# EAGLE design gamepad (EAGLE 9.5.1)
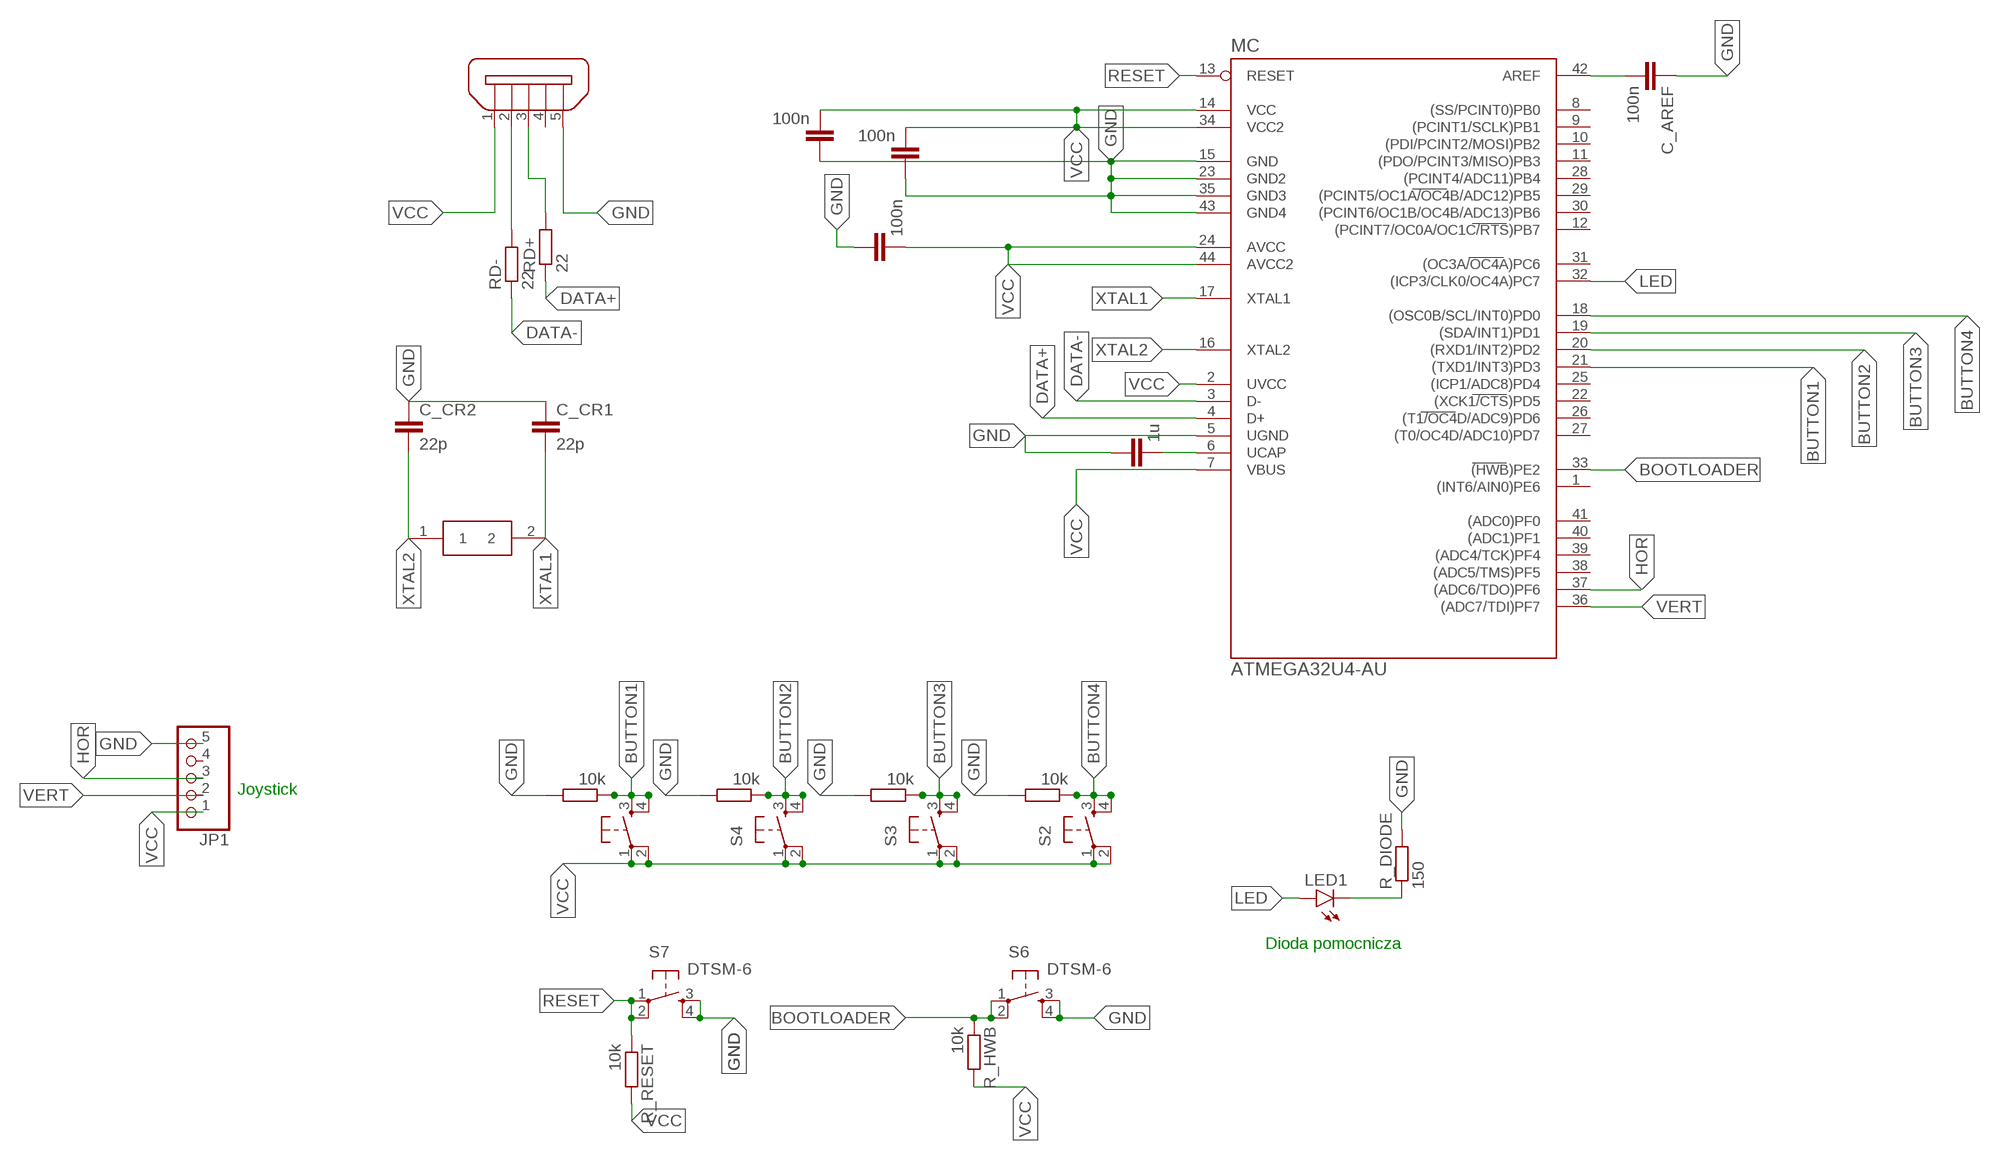
[diagram p0: schematic, sheet 1]

## Parts
C_AREF  100n  C-EUC0805  [C0805]
C_CR1  22p  C-EUC0805  [C0805]
C_CR2  22p  C-EUC0805  [C0805]
C_LPF  100n  C-EUC0805  [C0805]
C_UCAPR  1u  C-EUC0805  [C0805]
C_VCC_TO_GND_14  100n  C-EUC0805  [C0805]
C_VCC_TO_GND_33  100n  C-EUC0805  [C0805]
JP1  PINHD-1X5  [1X05]
LED1  LEDSML1206  [SML1206]
MC  ATMEGA32U4-AU  [TQFP44]
QUARTZ_OSC_ZAST  ECS-160-8-30Q-VY-TR  [ECS80830QVSTR]
R_DIODE  150  R-EU_R2512  [R2512]
R_H_SWITCH1  10k  R-EU_R0805  [R0805]
R_H_SWITCH2  10k  R-EU_R0805  [R0805]
R_H_SWITCH3  10k  R-EU_R0805  [R0805]
R_H_SWITCH4  10k  R-EU_R0805  [R0805]
R_HWB  10k  R-EU_R0805  [R0805]
R_RESET  10k  R-EU_R0805  [R0805]
RD+  22  R-EU_R0805  [R0805]
RD-  22  R-EU_R0805  [R0805]
S2  DTSM-6  [DTSM-6]
S3  DTSM-6  [DTSM-6]
S4  DTSM-6  [DTSM-6]
S5  DTSM-6  [DTSM-6]
S6  DTSM-6  [DTSM-6]
S7  DTSM-6  [DTSM-6]
X1  ZX62D-B-5PA8  [ZX62D-B-5PA8]

## Nets
BOOTLOADER: MC.33((HWB)PE2) R_HWB.1 S6.1 S6.2
BUTTON1: MC.21((TXD1/INT3)PD3) R_H_SWITCH1.1 S5.3 S5.4
BUTTON2: MC.20((RXD1/INT2)PD2) R_H_SWITCH2.1 S4.3 S4.4
BUTTON3: MC.19((SDA/INT1)PD1) R_H_SWITCH3.1 S3.3 S3.4
BUTTON4: MC.18((OSC0B/SCL/INT0)PD0) R_H_SWITCH4.1 S2.3 S2.4
DATA+: MC.4(D+) RD+.1
DATA+CON: RD+.2 X1.3
DATA-: MC.3(D-) RD-.1
DATA-CON: RD-.2 X1.2
GND: C_AREF.1 C_CR1.1 C_CR2.1 C_LPF.1 C_UCAPR.1 C_VCC_TO_GND_14.1 C_VCC_TO_GND_33.1 JP1.5 MC.5(UGND) MC.15(GND) MC.23(GND2) MC.35(GND3) MC.43(GND4) R_DIODE.2 R_H_SWITCH1.2 R_H_SWITCH2.2 R_H_SWITCH3.2 R_H_SWITCH4.2 S6.3 S6.4 S7.3 S7.4 X1.5
HOR: JP1.3 MC.37((ADC6/TDO)PF6)
LED: LED1.A MC.32((ICP3/CLK0/OC4A)PC7)
N$7: LED1.C R_DIODE.1
N$10: C_UCAPR.2 MC.6(UCAP)
N$23: C_AREF.2 MC.42(AREF)
RESET: MC.13(RESET) R_RESET.1 S7.1 S7.2
VCC: C_LPF.2 C_VCC_TO_GND_14.2 C_VCC_TO_GND_33.2 JP1.1 MC.2(UVCC) MC.7(VBUS) MC.14(VCC) MC.24(AVCC) MC.34(VCC2) MC.44(AVCC2) R_HWB.2 R_RESET.2 S2.1 S2.2 S3.1 S3.2 S4.1 S4.2 S5.1 S5.2 X1.1
VERT: JP1.2 MC.36((ADC7/TDI)PF7)
XTAL1: C_CR1.2 MC.17(XTAL1) QUARTZ_OSC_ZAST.2
XTAL2: C_CR2.2 MC.16(XTAL2) QUARTZ_OSC_ZAST.1
Unconnected: JP1.4 MC.1((INT6/AIN0)PE6) MC.8((SS/PCINT0)PB0) MC.9((PCINT1/SCLK)PB1) MC.10((PDI/PCINT2/MOSI)PB2) MC.11((PDO/PCINT3/MISO)PB3) MC.12((PCINT7/OC0A/OC1C/RTS)PB7) MC.22((XCK1/CTS)PD5) MC.25((ICP1/ADC8)PD4) MC.26((T1/OC4D/ADC9)PD6) MC.27((T0/OC4D/ADC10)PD7) MC.28((PCINT4/ADC11)PB4) MC.29((PCINT5/OC1A/OC4B/ADC12)PB5) MC.30((PCINT6/OC1B/OC4B/ADC13)PB6) MC.31((OC3A/OC4A)PC6) MC.38((ADC5/TMS)PF5) MC.39((ADC4/TCK)PF4) MC.40((ADC1)PF1) MC.41((ADC0)PF0) X1.4 X1.S1 X1.S2 X1.S3 X1.S4

## Notes on the sheet
- Joystick
- Dioda pomocnicza

## Library data of the parts
C_AREF C_CR1 C_CR2 C_LPF C_UCAPR C_VCC_TO_GND_14 C_VCC_TO_GND_33 = rcl:C-EU: CAPACITOR, European symbol; SPICEPREFIX: C
JP1 = pinhead:PINHD-1X5: PIN HEADER
LED1 = led:LED: LED OSRAM: - CHIPLED LG R971, LG N971, LY N971, LG Q971, LY Q971, LO R971, LY R971 LH N974, LH R974 LS Q976, LO Q976, LY Q976 LO Q996 - Hyper CHIPLED LW Q18S LB Q993, LB Q99A, LB R99A - SideLED LS A670, LO A670, LY A670, LG A670, LP A670 LB A673, LV A673, LT A673, LW A673 LH A674 LY A675 LS A676, LA A676, LO A676, LY A676, LW A676 LS A679, LY A679, LG A679 - Hyper Micro SIDELED® LS Y876, LA Y876, LO Y876, LY Y876 LT Y87S - SmartLED LW L88C, LW L88S LB L89C, LB L89S, LG L890 LS L89K, LO L89K, LY L89K LS L896, LA L896, LO L896, LY L896 - TOPLED LS T670, LO T670, LY T670, LG T670, LP T670 LSG T670, LSP T670, LSY T670, LOP T670, LYG T670 LG T671, LOG T671, LSG T671 LB T673, LV T673, LT T673, LW T673 LH T674 LS T676, LA T676, LO T676, LY T676, LB T676, LH T676, LSB T676, LW T676 LB T67C, LV T67C, LT T67C, LS T67K, LO T67K, LY T67K, LW E67C LS E67B, LA E67B, LO E67B, LY E67B, LB E67C, LV E67C, LT E67C LW T67C LS T679, LY T679, LG T679 LS T770, LO T770, LY T770, LG T770, LP T770 LB T773, LV T773, LT T773, LW T773 LH T774 LS E675, LA E675, LY E675, LS T675 LS T776, LA T776, LO T776, LY T776, LB T776 LHGB T686 LT T68C, LB T68C - Hyper Mini TOPLED® LB M676 - Mini TOPLED Santana® LG M470 LS M47K, LO M47K, LY M47K Source: http://www.osram.convergy.de LUXEON: - LUMILED® LXK2-PW12-R00, LXK2-PW12-S00, LXK2-PW14-U00, LXK2-PW14-V00 LXK2-PM12-R00, LXK2-PM12-S00, LXK2-PM14-U00 LXK2-PE12-Q00, LXK2-PE12-R00, LXK2-PE12-S00, LXK2-PE14-T00, LXK2-PE14-U00 LXK2-PB12-K00, LXK2-PB12-L00, LXK2-PB12-M00, LXK2-PB14-N00, LXK2-PB14-P00, LXK2-PB14-Q00 LXK2-PR12-L00, LXK2-PR12-M00, LXK2-PR14-Q00, LXK2-PR14-R00 LXK2-PD12-Q00, LXK2-PD12-R00, LXK2-PD12-S00 LXK2-PH12-R00, LXK2-PH12-S00 LXK2-PL12-P00, LXK2-PL12-Q00, LXK2-PL12-R00 Source: www.luxeon.com KINGBRIGHT: KA-3528ASYC Source: www.kingbright.com
MC = mega32U4:ATMEGA32U4-AU
QUARTZ_OSC_ZAST = ECS-160-8-30Q-VY-TR:ECS-160-8-30Q-VY-TR: Crystals 16MHz 8pF AEC ESR 50 -40C +150C Source: Datasheet <https://media.digikey.com/pdf/Data Sheets/ECS PDFs/ECX-53Q_DS.pdf>; DESCRIPTION: Crystals 16MHz 8pF AEC ESR 50 -40C +150C; HEIGHT: 1.1mm; MANUFACTURER_NAME: ECS; MANUFACTURER_PART_NUMBER: ECS-160-8-30Q-VY-TR; MOUSER_PART_NUMBER: 520-160-8-30Q-VYT; MOUSER_PRICE-STOCK: https://www.mouser.com/Search/Refine.aspx?Keyword=520-160-8-30Q-VYT
R_DIODE R_H_SWITCH1-R_H_SWITCH4 R_HWB R_RESET RD+ RD- = rcl:R-EU_: RESISTOR, European symbol; SPICEPREFIX: R
S2-S7 = switch-tact:DTSM-6
X1 = zx62d-b-5pa8-oshpark_10:ZX62D-B-5PA8: Micro USB Type B Connector - Standard, Shell Through Hole Source: http://www.hirose.co.jp/cataloge_hp/ed_ZX_20140804.pdf; MF: Hirose; MPN: ZX62D-B-5PA8; OC_FARNELL: 2300438; OC_NEWARK: 69W0712

## Board
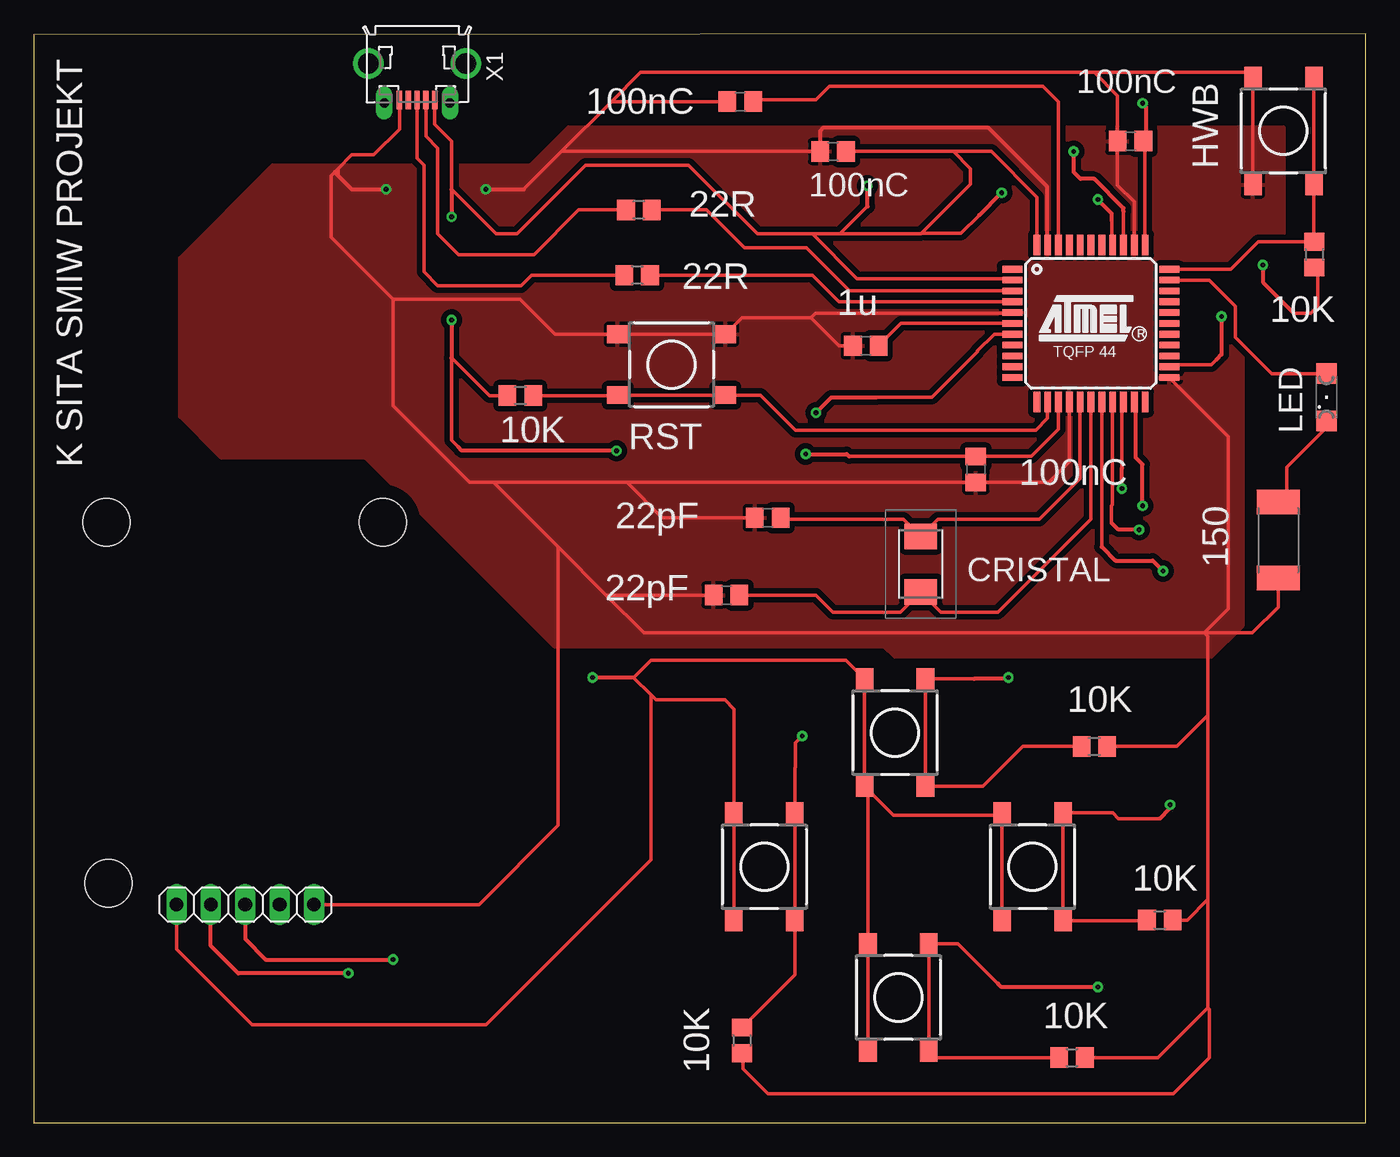
[diagram p1: board, top side]
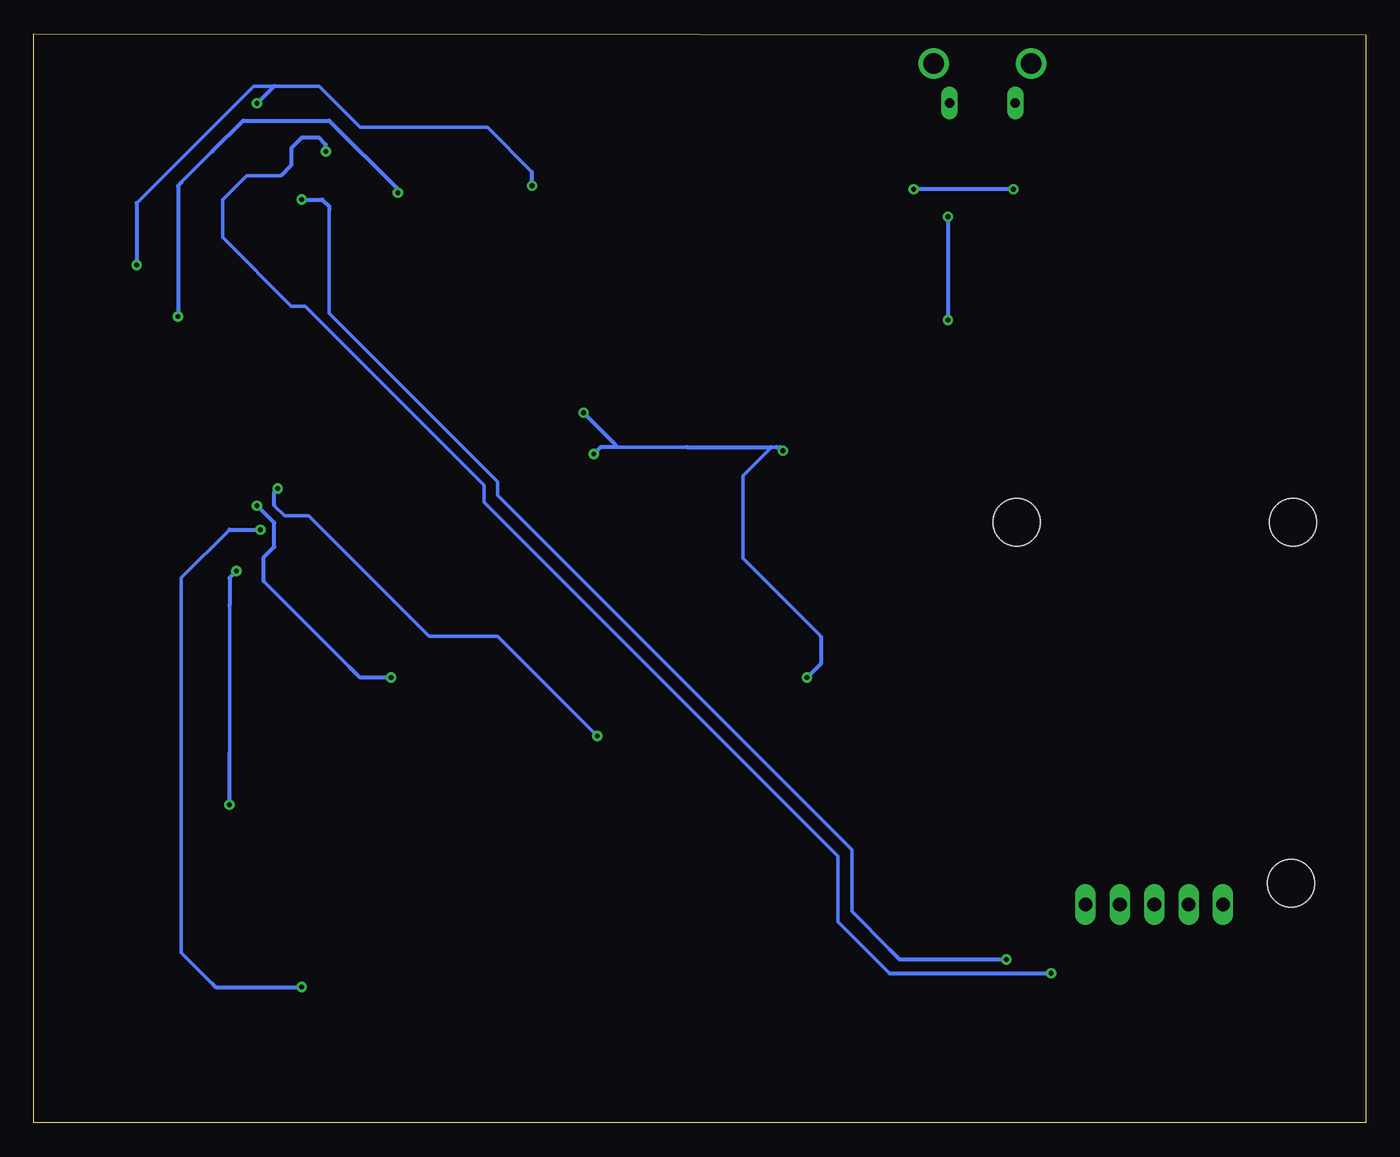
[diagram p2: board, bottom side, seen from below]

Size 98.41 x 80.44 mm. Coordinates in mm from the lower left corner, seen from the top.
Outline: 0,0 98.41,0 98.41,80.44 0,80.37 0,0
Copper layers (1*16): Top 0.035mm / dielectric 1.5mm / Bottom 0.035mm
Design rules "default": minimum track width 6mil, minimum drill 0.35mm, track to track 6mil, track to pad 6mil, pad to pad 6mil, via to via 6mil, smd to smd 6mil, copper to edge 40mil, drill to drill 6mil, minimum pad ring 10mil, minimum via ring 8mil, stop-mask expansion 4mil, vias tented up to drill 0mil, thermal gap 10mil
Holes 3.5 mm at 5.51,17.7 5.36,44.37 25.78,44.37

### Footprints (pad centres in the part's own frame; a part is rotated, then mirrored left to right if it is on the bottom)
C0805 = smd 1.3 x 1.5: 1 -0.95,0; 2 0.95,0
1X05 = drill 1.016 long: 1 -5.08,0; 2 -2.54,0; 3 0,0; 4 2.54,0; 5 5.08,0
SML1206 = smd 1.5 x 1.5: A 1.75,0; C -1.75,0
TQFP44 = smd 1.5 x 0.5: 1 -5.8,4; 2 -5.8,3.2; 3 -5.8,2.4; 4 -5.8,1.6; 5 -5.8,0.8; 6 -5.8,0; 7 -5.8,-0.8; 8 -5.8,-1.6; 9 -5.8,-2.4; 10 -5.8,-3.2; 11 -5.8,-4; 23 5.8,-4; 24 5.8,-3.2; 25 5.8,-2.4; 26 5.8,-1.6; 27 5.8,-0.8; 28 5.8,0; 29 5.8,0.8; 30 5.8,1.6; 31 5.8,2.4; 32 5.8,3.2; 33 5.8,4 | smd 0.5 x 1.5: 12 -4,-5.8; 13 -3.2,-5.8; 14 -2.4,-5.8; 15 -1.6,-5.8; 16 -0.8,-5.8; 17 0,-5.8; 18 0.8,-5.8; 19 1.6,-5.8; 20 2.4,-5.8; 21 3.2,-5.8; 22 4,-5.8; 34 4,5.8; 35 3.2,5.8; 36 2.4,5.8; 37 1.6,5.8; 38 0.8,5.8; 39 0,5.8; 40 -0.8,5.8; 41 -1.6,5.8; 42 -2.4,5.8; 43 -3.2,5.8; 44 -4,5.8
ECS80830QVSTR = smd 1.9 x 2.4: 1 -2.05,0; 2 2.05,0
R2512 = smd 1.8 x 3.2: 1 -2.8,0; 2 2.8,0
R0805 = smd 1.3 x 1.5: 1 -0.95,0; 2 0.95,0
DTSM-6 = smd 1.55 x 1.3: 1 -3.975,2.25; 2 3.975,2.25; 3 -3.975,-2.25; 4 3.975,-2.25
ZX62D-B-5PA8 = smd 1.35 x 0.4: 1 4.825,1.3; 2 4.825,0.65; 3 4.825,0; 4 4.825,-0.65; 5 4.825,-1.3 | drill 1.5: S1 2.15,-3.6; S2 2.15,3.6 | drill 0.7 long: S3 5.05,2.425; S4 5.05,-2.425

### Placement (x,y rotation side)
C_AREF  52.2,75.44 0 top
C_CR1  51.18,38.99 0 top
C_CR2  54.23,44.7 0 top
C_LPF  59.06,71.75 0 top
C_UCAPR  61.47,57.4 0 top
C_VCC_TO_GND_14  69.6,48.26 90 top
C_VCC_TO_GND_33  81.03,72.52 0 top
JP1  15.62,16.13 0 top
LED1  95.5,53.59 90 top
MC  78.1,59.05 0 top
QUARTZ_OSC_ZAST  65.53,41.28 270 top
R_DIODE  91.95,43.05 270 top
R_H_SWITCH1  78.36,27.81 0 top
R_H_SWITCH2  52.32,6.1 270 top
R_H_SWITCH3  76.71,4.83 0 top
R_H_SWITCH4  83.19,14.99 0 top
R_HWB  94.62,64.13 270 top
R_RESET  35.94,53.72 180 top
RD+  44.58,62.61 180 top
RD-  44.7,67.44 180 top
S2  73.79,18.92 90 top
S3  63.88,9.27 90 top
S4  53.97,18.92 90 top
S5  63.63,28.83 90 top
S6  92.33,73.28 270 top
S7  47.12,56.01 180 top
X1  28.32,80.39 270 top

### Tracks (layer width: path | path; a pad name or v marks a point on that pad's centre or on a via)
BOOTLOADER
  Top 0.254: MC.33 88.46,63.05 90.49,65.08 R_HWB.1 94.58,65.12 S6.2 S6.1
BUTTON1  (via drill 0.35 pad 0.7)
  Top 0.254: 81.41,53.15 MC.21 | R_H_SWITCH1.1 73.09,27.81 70.13,24.85 S5.3 S5.4 69.47,32.8 69.63,32.8
  Top 0.305: v81.91,45.59 81.91,48.64 81.41,49.15 81.41,53.15 | v72.01,32.89 71.92,32.8 69.47,32.8
  Bottom 0.254: 75.06,33.66 81.41,40
  Bottom 0.305: 81.41,40 81.41,41.78 80.65,42.55 80.65,44.32 v81.91,45.59 | v72.01,32.89 74.29,32.89 75.06,33.66
BUTTON2  (via drill 0.35, 0.35 pad 0.7)
  Top 0.254: 80.65,53.11 80.6,53.16 | 80.6,53.16 MC.20 | R_H_SWITCH2.1 56.22,10.95 S4.3 S4.4 56.22,26.25 56.26,26.29 56.26,28.07 v56.77,28.57 | 80.39,48.39 80.39,52.96 80.6,53.16
  Top 0.305: v80.39,46.86 80.39,48.39
  Bottom 0.254: 80.65,45.59 79.88,44.83 78.1,44.83 69.22,35.94 64.14,35.94 v56.77,28.57
  Bottom 0.305: 80.65,45.59 80.65,46.61 v80.39,46.86
BUTTON3  (via drill 0.35 pad 0.7)
  Top 0.254: MC.19 79.71,45.67 79.63,45.59 79.63,44.32 | R_H_SWITCH3.1 66.6,4.83 S3.3 S3.4 68.29,13.25 71.25,10.29
  Top 0.305: v81.66,43.81 80.14,43.81 79.63,44.32 | v78.61,10.03 71.5,10.03 71.25,10.29
  Bottom 0.254: 83.95,43.81 87.5,40.26 87.5,12.57 85.22,10.29
  Bottom 0.305: 83.95,43.81 v81.66,43.81 | 85.22,10.29 84.96,10.03 v78.61,10.03
BUTTON4  (via drill 0.35 pad 0.7)
  Top 0.254: MC.18 78.91,42.55 | R_H_SWITCH4.1 82.2,14.95 S2.3 S2.4 79.72,22.9 80.14,22.48 83.19,22.48
  Top 0.305: 78.91,42.55 79.92,41.53 82.68,41.53 v83.44,40.77 | 83.19,22.48 83.95,23.24 v83.95,23.5
  Bottom 0.254: 83.95,38.48 83.95,38.23 83.95,27.31
  Bottom 0.305: v83.44,40.77 83.95,40.26 83.95,38.23 | v83.95,23.5 83.95,27.31
DATA+
  Top 0.254: MC.4 59.49,60.66 57.53,62.61 RD+.1
DATA+CON
  Top 0.254: X1.3 28.32,71.25 28.83,70.74 28.83,62.86 29.84,61.85 36.01,61.85 36.77,62.61 RD+.2
DATA-
  Top 0.254: MC.3 60.27,61.45 57.08,64.64 52.51,64.64 49.72,67.44 RD-.1
DATA-CON
  Top 0.254: X1.2 28.97,72.88 29.84,72.01 29.84,65.66 31.37,64.13 36.96,64.13 40.26,67.44 RD-.2
GND  (via drill 0.35 pad 0.7)
  Top 0.254: 36.2,68.96 38.99,71.75 | 38.99,71.75 42.67,75.44 | 42.67,75.44 44.83,77.6 78.36,77.6 | 78.36,77.6 80.08,75.88 C_VCC_TO_GND_33.1 80.08,69.28 81.31,68.05 MC.35 | 49.98,39.24 C_CR1.1 42.29,38.99 | MC.15 76.5,48.82 75,47.31 C_VCC_TO_GND_14.1 43.81,47.31 | MC.43 74.83,64.93 | MC.23 88.27,50.69 88.27,37.97 86.49,36.2 | MC.5 72.27,59.82 57.74,59.82 57.4,59.48 | C_UCAPR.1 59.48,57.4 57.4,59.48 | R_DIODE.2 91.95,38.1 90.04,36.2 86.49,36.2 | 86.74,30.1 86.74,35.94 86.49,36.2 | 86.74,30.1 86.74,16.51 | 26.54,60.83 35.94,60.83 38.52,58.26 S7.4 S7.3 52.31,59.48 57.4,59.48 | 26.54,60.83 21.97,65.41 21.97,69.98 22.22,70.23 22.48,70.48 | S6.4 S6.3 89.74,77.6 78.36,77.6 | 26.54,60.83 26.54,52.96 32.19,47.31 33.97,47.31 | JP1.5 32.89,16.13 38.73,21.97 38.73,42.55 | 86.74,8.51 83.06,4.83 R_H_SWITCH3.2 | R_H_SWITCH2.2 52.39,5.09 52.39,4 54.23,2.16 84.2,2.16 86.87,4.83 86.87,8.38 86.74,8.51 | 86.74,16.51 86.74,8.51 | R_H_SWITCH4.2 85.22,14.99 86.74,16.51 | R_H_SWITCH1.2 84.46,27.81 86.74,30.1 | 22.48,70.48 23.5,71.5 25.12,71.5 27.02,73.4 X1.5 | 38.73,42.55 42.29,38.99 | 42.29,38.99 45.09,36.2 86.49,36.2 | C_CR2.1 46.42,44.7 43.81,47.31 | 43.81,47.31 33.97,47.31 | 38.73,42.55 33.97,47.31 | 22.48,70.48 22.48,69.98 | C_AREF.1 42.67,75.44 | 38.99,71.75 C_LPF.1
  Top 0.305: 22.22,70.23 22.48,69.98 23.5,68.96 v26.03,68.96 | v33.4,68.96 36.2,68.96 | C_LPF.1 58.11,73.28 58.36,73.53 70.49,73.53 74.83,69.19 74.83,64.93
  Bottom 0.305: v26.03,68.96 v33.4,68.96
  pour Top (isolate 0.406): 10.8,63.88 17.65,70.74 36.7,70.74 39.5,73.53 92.33,73.53 92.33,61.59 89.28,58.55 89.28,36.7 87,34.42 63.63,34.42 62.86,35.18 38.48,35.18 24.51,49.15 13.84,49.15 10.8,52.2
HOR  (via drill 0.35 pad 0.7)
  Top 0.254: MC.37 79.65,64.91 | 79.65,64.91 79.63,64.93 | 79.65,64.91 79.65,66.66
  Top 0.305: JP1.3 15.62,13.59 17.14,12.07 v26.54,12.07 | 79.65,66.66 79.65,67.17 v78.61,68.2
  Bottom 0.254: 76.58,67.44 76.58,59.82 64.14,47.37 64.14,46.36 37.97,20.19 37.97,15.62 35.18,12.83
  Bottom 0.305: v78.61,68.2 77.09,68.2 76.58,67.69 76.58,67.44 | v26.54,12.07 29.08,12.07 | 29.08,12.07 34.42,12.07 35.18,12.83 | 29.08,12.07
LED
  Top 0.254: MC.32 86.84,62.25 88.77,60.33 88.77,58.04 91.47,55.34 LED1.A
N$7
  Top 0.254: LED1.C 95.5,51.34 92.58,48.41 92.58,46.49 R_DIODE.1
N$10
  Top 0.254: C_UCAPR.2 64.07,59.05 MC.6
N$23
  Top 0.254: C_AREF.2 53.27,75.56 57.78,75.56 58.8,76.58 74.55,76.58 75.71,75.42 MC.42
RESET
  Top 0.254: MC.13 74.91,52.05 74.04,51.18 56.26,51.18 53.69,53.76 S7.1 S7.2 43.11,53.72 R_RESET.1 | 36.89,53.85 R_RESET.1 | 37.02,53.59 R_RESET.1
VCC  (via drill 0.35 pad 0.65, 0.35 pad 0.7)
  Top 0.152: 34.42,53.72 R_RESET.2
  Top 0.254: 31.37,49.91 30.86,50.42 30.86,56.52 33.66,53.72 R_RESET.2 | 45.59,31.62 45.59,19.43 33.4,7.24 16.13,7.24 10.54,12.83 JP1.1 | 82.17,72.71 C_VCC_TO_GND_33.2 82.1,72.39 MC.34 | C_VCC_TO_GND_14.2 69.63,49.24 | MC.14 75.71,51.25 73.69,49.24 69.63,49.24 | MC.2 72.2,62.36 60.83,62.36 57.53,65.66 | 59.56,65.66 57.53,65.66 | 57.53,65.66 53.47,65.66 48.39,70.74 40.77,70.74 35.69,65.66 34.16,65.66 30.86,68.96 30.86,72.52 29.62,73.76 X1.1 | 59.56,65.66 61.59,67.69 | 59.56,65.66 65.53,65.66 65.58,65.71 | R_HWB.2 94.87,62.93 94.87,60.33 94.36,59.82 93.09,59.82 | S5.1 61.63,24.6 S3.2 S3.1 | S4.1 S4.2 51.72,30.57 51.05,31.24 45.97,31.24 45.59,31.62 | S5.1 S5.2 60.02,34.16 45.59,34.16 44.32,32.89 45.59,31.62 | S2.2 71.54,22.73 | 71.54,22.73 S2.1 | 71.54,22.73 63.5,22.73 S5.1 | 60.23,49.24 69.63,49.24 | MC.7 70.96,58.25 69.72,57.02 69.72,56.96 66.36,53.59 62.23,53.59 | C_LPF.2 67.94,71.75 | MC.24 84.06,56.01 87,56.01 87.38,56.39 87.5,56.52 | 67.94,71.75 69.22,70.48 69.22,69.34 65.58,65.71 | 67.94,71.75 70.74,71.75 74.1,68.39 MC.44 | 65.58,65.71 68.5,65.71 69.85,67.06
  Top 0.305: 61.59,67.69 v61.59,69.22 | v81.91,75.31 82.17,75.06 82.17,72.71 | 30.86,68.96 v30.86,66.93 | v30.86,59.31 30.86,56.52 | v90.81,63.37 90.81,62.1 93.09,59.82 | 44.32,32.89 v41.28,32.89 | v57.02,49.4 60.07,49.4 60.23,49.24 | v57.78,52.45 58.93,53.59 62.23,53.59 | v43.05,49.66 31.62,49.66 31.37,49.91 | v87.76,59.56 87.76,56.77 87.38,56.39 | 69.85,67.06 v71.5,68.71
  Bottom 0.254: 61.59,70.23 64.9,73.53 74.29,73.53 77.34,76.58 80.65,76.58 82.17,76.58 90.81,67.94 | 50.17,49.91 55.25,49.91 55.5,50.16 | 40.26,35.94 46.03,41.71 46.03,47.8 43.92,49.91 43.56,49.91 | 87.5,69.47 85.22,71.75
  Bottom 0.305: 80.65,76.58 v81.91,75.31 | v61.59,69.22 61.59,70.23 | v30.86,66.93 v30.86,59.31 | 90.81,67.94 v90.81,63.37 | v41.28,32.89 40.26,33.91 40.26,35.94 | 55.25,49.91 56.52,49.91 v57.02,49.4 | 55.5,50.16 v57.78,52.45 | 50.17,49.91 43.92,49.91 | 43.56,49.91 43.31,49.91 v43.05,49.66 | 87.5,69.47 87.76,69.22 v87.76,59.56 | 85.22,71.75 82.93,74.04 76.58,74.04 71.5,68.96 v71.5,68.71
VERT  (via drill 0.35 pad 0.7)
  Top 0.254: MC.36 80.5,67.32
  Top 0.305: JP1.2 13.08,13.08 15.11,11.05 v23.24,11.05 | 80.5,67.32 80.5,67.58 78.36,69.72 77.34,69.72 76.84,70.23 v76.84,71.75
  Bottom 0.254: 80.14,69.98 82.68,69.98 84.46,68.2 84.46,65.41 79.38,60.33 78.36,60.33 65.15,47.12 65.15,45.85 38.99,19.68 38.99,14.86 35.18,11.05
  Bottom 0.305: v76.84,71.75 76.84,72.26 77.34,72.77 78.61,72.77 79.38,72.01 79.38,70.74 80.14,69.98 | 35.18,11.05 v23.24,11.05
XTAL1
  Top 0.254: MC.17 78.1,44.58 71.25,37.72 67.04,37.72 QUARTZ_OSC_ZAST.2 | QUARTZ_OSC_ZAST.2 65.68,39.37 | C_CR1.2 57.78,38.99 59.06,37.72 64.03,37.72 QUARTZ_OSC_ZAST.2
XTAL2
  Top 0.254: C_CR2.2 55.28,44.61 | 55.28,44.61 55.29,44.59 | QUARTZ_OSC_ZAST.1 65.66,43.33 | MC.16 77.31,47.59 74.29,44.58 74.28,44.59 66.8,44.59 QUARTZ_OSC_ZAST.1 | 65.53,43.18 QUARTZ_OSC_ZAST.1 | QUARTZ_OSC_ZAST.1 64.25,44.61 55.28,44.61

### Text on the board
tNames: K SITA SMIW PROJEKT | 100nC | 100nC | HWB | 100nC | 22R | 22R | 1u | 10K | 10K | RST | LED | 100nC | 22pF | 150 | 22pF | CRISTAL | 10K | 10K | 10K | 10K